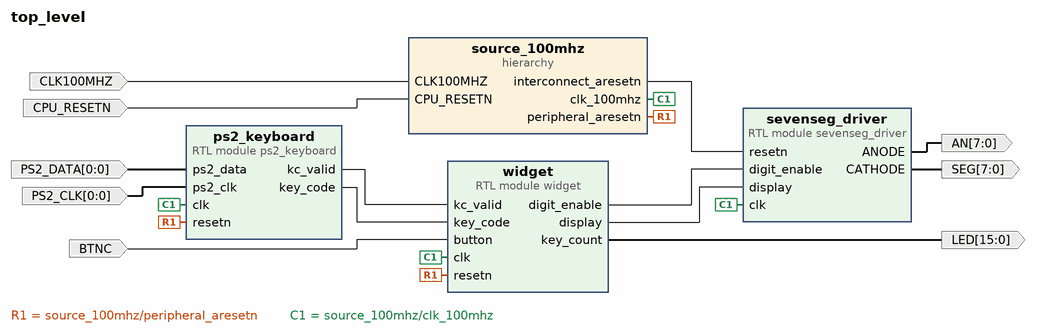
[diagram p0: block diagram of the top level]
# Vivado block design top_level, xc7a100tcsg324-1, Vivado 2021.1
create_bd_design top_level

create_bd_port -dir I -type clk CLK100MHZ
set_property -dict {CONFIG.ASSOCIATED_RESET CPU_RESETN} [get_bd_ports CLK100MHZ]
create_bd_port -dir I -type rst CPU_RESETN
create_bd_port -dir O -from 7 -to 0 SEG
create_bd_port -dir O -from 7 -to 0 AN
create_bd_port -dir I -from 0 -to 0 PS2_DATA
create_bd_port -dir I -from 0 -to 0 PS2_CLK
create_bd_port -dir O -from 15 -to 0 LED
create_bd_port -dir I BTNC

create_bd_cell -type hier source_100mhz
create_bd_cell -type module -reference sevenseg_driver sevenseg_driver
create_bd_cell -type module -reference widget widget
create_bd_cell -type module -reference ps2_keyboard ps2_keyboard

# ---- hierarchy /source_100mhz ----
current_bd_instance /source_100mhz
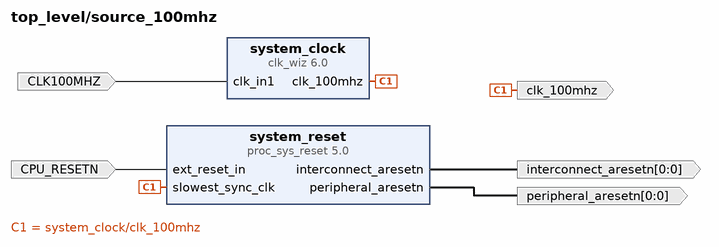
[diagram p1: block diagram inside /source_100mhz]
create_bd_pin -dir I -type clk CLK100MHZ
create_bd_pin -dir O -type clk clk_100mhz
create_bd_pin -dir I -type rst CPU_RESETN
create_bd_pin -dir O -from 0 -to 0 -type rst interconnect_aresetn
create_bd_pin -dir O -from 0 -to 0 -type rst peripheral_aresetn

create_bd_cell -type ip -vlnv xilinx.com:ip:clk_wiz:6.0 system_clock
set_property -dict [list \
  CONFIG.CLKOUT1_DRIVES BUFGCE \
  CONFIG.CLKOUT2_DRIVES BUFGCE \
  CONFIG.CLKOUT3_DRIVES BUFGCE \
  CONFIG.CLKOUT4_DRIVES BUFGCE \
  CONFIG.CLKOUT5_DRIVES BUFGCE \
  CONFIG.CLKOUT6_DRIVES BUFGCE \
  CONFIG.CLKOUT7_DRIVES BUFGCE \
  CONFIG.CLK_OUT1_PORT clk_100mhz \
  CONFIG.FEEDBACK_SOURCE FDBK_AUTO \
  CONFIG.USE_LOCKED false \
  CONFIG.USE_RESET false \
  CONFIG.USE_SAFE_CLOCK_STARTUP true \
] [get_bd_cells system_clock]
create_bd_cell -type ip -vlnv xilinx.com:ip:proc_sys_reset:5.0 system_reset

# ---- connections ----

current_bd_instance /source_100mhz
connect_bd_net [get_bd_pins CLK100MHZ] [get_bd_pins system_clock/clk_in1]
connect_bd_net [get_bd_pins CPU_RESETN] [get_bd_pins system_reset/ext_reset_in]
connect_bd_net [get_bd_pins system_clock/clk_100mhz] [get_bd_pins clk_100mhz] [get_bd_pins system_reset/slowest_sync_clk]
connect_bd_net [get_bd_pins system_reset/interconnect_aresetn] [get_bd_pins interconnect_aresetn]
connect_bd_net [get_bd_pins system_reset/peripheral_aresetn] [get_bd_pins peripheral_aresetn]

current_bd_instance /
connect_bd_net [get_bd_ports CLK100MHZ] [get_bd_pins source_100mhz/CLK100MHZ]
connect_bd_net [get_bd_ports CPU_RESETN] [get_bd_pins source_100mhz/CPU_RESETN]
connect_bd_net -net button_0_1 [get_bd_ports BTNC] [get_bd_pins widget/button]
connect_bd_net -net probe0_0_1 [get_bd_ports PS2_DATA] [get_bd_pins ps2_keyboard/ps2_data]
connect_bd_net -net probe1_0_1 [get_bd_ports PS2_CLK] [get_bd_pins ps2_keyboard/ps2_clk]
connect_bd_net [get_bd_pins ps2_keyboard/kc_valid] [get_bd_pins widget/kc_valid]
connect_bd_net [get_bd_pins ps2_keyboard/key_code] [get_bd_pins widget/key_code]
connect_bd_net [get_bd_pins sevenseg_driver/ANODE] [get_bd_ports AN]
connect_bd_net [get_bd_pins sevenseg_driver/CATHODE] [get_bd_ports SEG]
connect_bd_net [get_bd_pins source_100mhz/interconnect_aresetn] [get_bd_pins sevenseg_driver/resetn]
connect_bd_net [get_bd_pins source_100mhz/peripheral_aresetn] [get_bd_pins widget/resetn] [get_bd_pins ps2_keyboard/resetn]
connect_bd_net -net system_clock_clk_100mhz [get_bd_pins source_100mhz/clk_100mhz] \
  [get_bd_pins sevenseg_driver/clk] [get_bd_pins widget/clk] [get_bd_pins ps2_keyboard/clk]
connect_bd_net [get_bd_pins widget/digit_enable] [get_bd_pins sevenseg_driver/digit_enable]
connect_bd_net [get_bd_pins widget/display] [get_bd_pins sevenseg_driver/display]
connect_bd_net [get_bd_pins widget/key_count] [get_bd_ports LED]

validate_bd_design
save_bd_design
